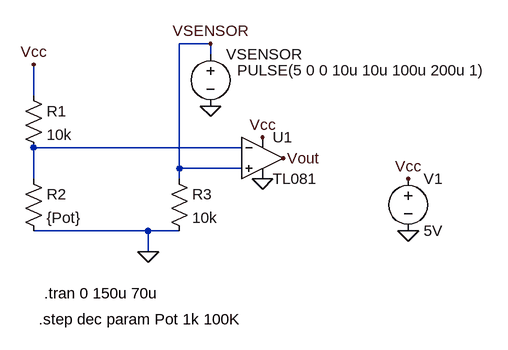
[diagram p0: schematic sim2.asc]
sim2.asc, the LTspice schematic file:
Version 4
SHEET 1 884 680
WIRE 432 -48 384 -48
WIRE 432 -32 432 -48
WIRE 160 32 160 -16
WIRE 480 112 160 112
WIRE 384 144 384 -48
WIRE 480 144 384 144
WIRE 160 160 160 112
WIRE 384 160 384 144
WIRE 336 240 160 240
WIRE 384 240 336 240
WIRE 336 272 336 240
FLAG 736 160 Vcc
FLAG 736 240 0
FLAG 336 272 0
FLAG 160 -16 Vcc
FLAG 512 96 Vcc
FLAG 512 160 0
FLAG 432 -48 VSENSOR
FLAG 544 128 Vout
FLAG 432 48 0
SYMBOL TL081 512 64 R0
SYMATTR InstName U1
SYMBOL res 144 16 R0
SYMATTR InstName R1
SYMATTR Value 10k
SYMBOL res 144 144 R0
SYMATTR InstName R2
SYMATTR Value {Pot}
SYMBOL res 368 144 R0
SYMATTR InstName R3
SYMATTR Value 10k
SYMBOL voltage 736 144 R0
SYMATTR InstName V1
SYMATTR Value 5V
SYMBOL voltage 432 -48 R0
WINDOW 3 41 41 Left 2
WINDOW 123 0 0 Left 0
WINDOW 39 0 0 Left 0
SYMATTR Value PULSE(5 0 0 10u 10u 100u 200u 1)
SYMATTR InstName VSENSOR
TEXT 176 336 Left 2 !.tran 0 150u 70u
TEXT 168 376 Left 2 !.step dec param Pot 1k 100K

The netlist it stands for:
* sim2.asc
* U1: TL081 (symbol TL081 not available, pins judged from their places): In+=VSENSOR In-=N001 V+=Vcc V-=0 OUT=Vout
R1 Vcc N001 10k
R2 N001 0 {Pot}
R3 VSENSOR 0 10k
V1 Vcc 0 5V
VSENSOR VSENSOR 0 PULSE(5 0 0 10u 10u 100u 200u 1)
.tran 0 150u 70u
.step dec param Pot 1k 100K
.backanno
.end